# Altium schematic sheet ForceACQ.SchDoc: ForceACQ
size A4; Author: João Guimarães; Revision: 2.0; SheetNumber: 5; SheetTotal: 9
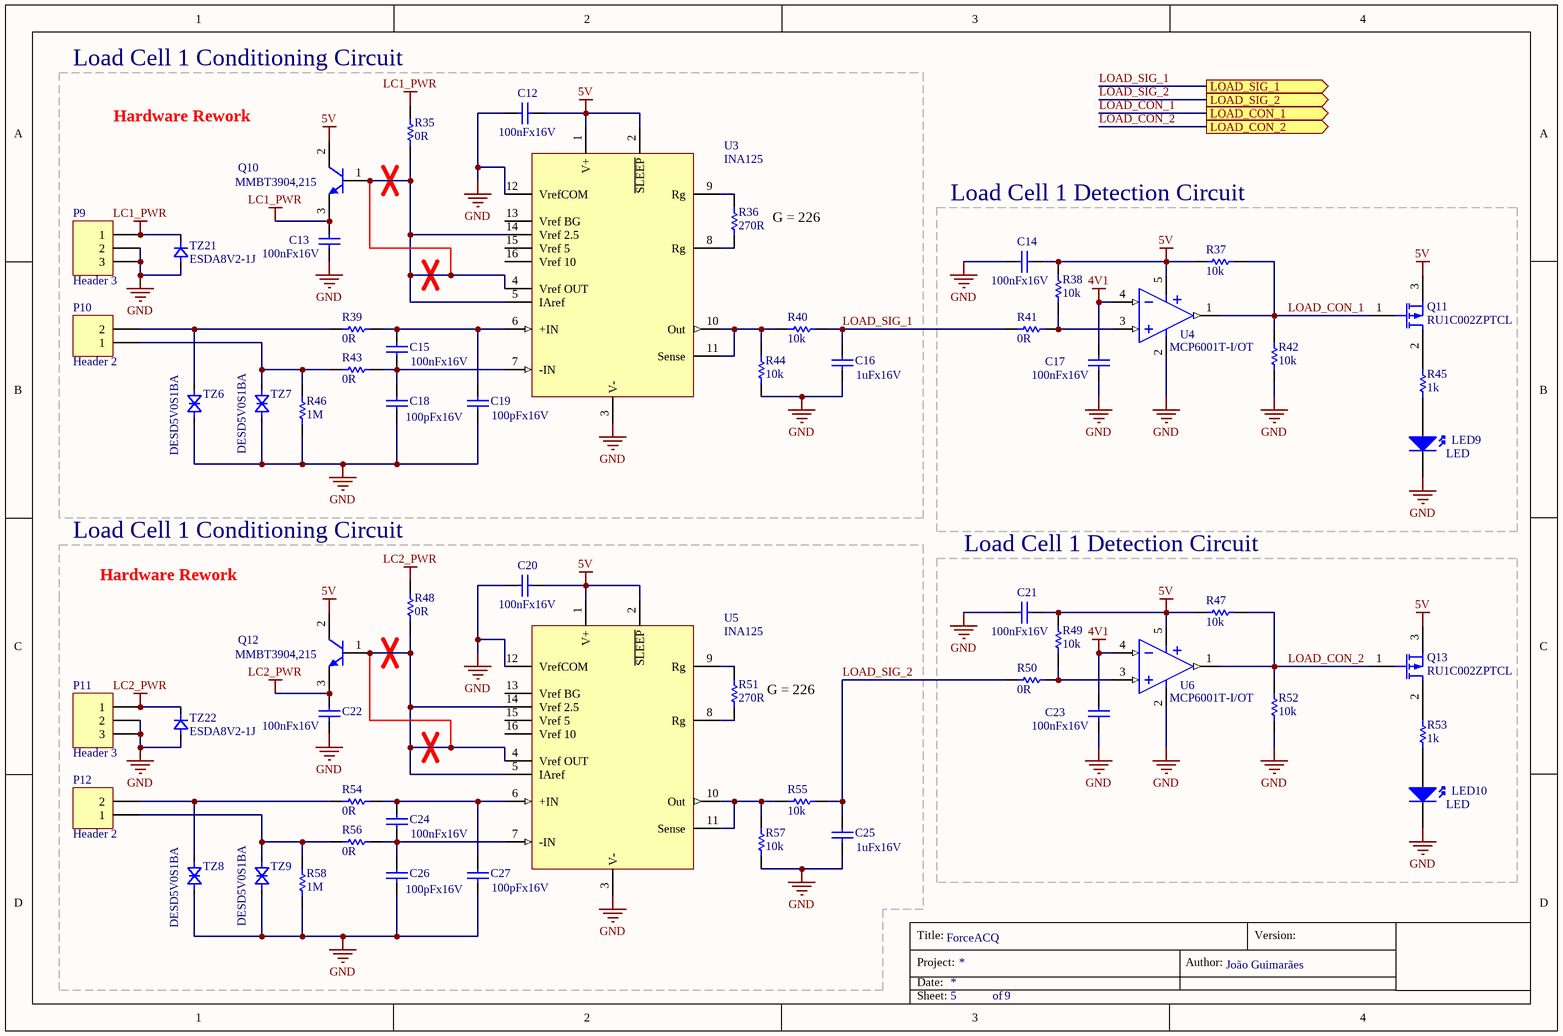
[diagram p0: ForceACQ.SchDoc]

## Parts
C12  100nFx16V  [DISC-0805]
C13  100nFx16V  [DISC-0805]
C14  100nFx16V  [DISC-0805]
C15  100nFx16V  [DISC-0805]
C16  1uFx16V  [DISC-0805]
C17  100nFx16V  [DISC-0805]
C18  100pFx16V  [DISC-0805]
C19  100pFx16V  [DISC-0805]
C20  100nFx16V  [DISC-0805]
C21  100nFx16V  [DISC-0805]
C22  100nFx16V  [DISC-0805]
C23  100nFx16V  [DISC-0805]
C24  100nFx16V  [DISC-0805]
C25  1uFx16V  [DISC-0805]
C26  100pFx16V  [DISC-0805]
C27  100pFx16V  [DISC-0805]
LED9  LED  [DISC-LED-0.1-PTH]
LED10  LED  [DISC-LED-0.1-PTH]
P9  Header 3  [CON-FLEXWIRE-0.5MM2-1X3]
P10  Header 2  [CON-FLEXWIRE-0.5MM2-1X2]
P11  Header 3  [CON-FLEXWIRE-0.5MM2-1X3]
P12  Header 2  [CON-FLEXWIRE-0.5MM2-1X2]
Q10  MMBT3904,215  [DISC-SOT-23]
Q11  RU1C002ZPTCL  [DISC-SOT-23]
Q12  MMBT3904,215  [DISC-SOT-23]
Q13  RU1C002ZPTCL  [DISC-SOT-23]
R35  0R  [DISC-0805]
R36  270R  [DISC-0805]
R37  10k  [DISC-0805]
R38  10k  [DISC-0805]
R39  0R  [DISC-0805]
R40  10k  [DISC-0805]
R41  0R  [DISC-0805]
R42  10k  [DISC-0805]
R43  0R  [DISC-0805]
R44  10k  [DISC-0805]
R45  1k  [DISC-0805]
R46  1M  [DISC-0805]
R47  10k  [DISC-0805]
R48  0R  [DISC-0805]
R49  10k  [DISC-0805]
R50  0R  [DISC-0805]
R51  270R  [DISC-0805]
R52  10k  [DISC-0805]
R53  1k  [DISC-0805]
R54  0R  [DISC-0805]
R55  10k  [DISC-0805]
R56  0R  [DISC-0805]
R57  10k  [DISC-0805]
R58  1M  [DISC-0805]
TZ6  DESD5V0S1BA  [DISC-SOD-323]
TZ7  DESD5V0S1BA  [DISC-SOD-323]
TZ8  DESD5V0S1BA  [DISC-SOD-323]
TZ9  DESD5V0S1BA  [DISC-SOD-323]
TZ21  ESDA8V2-1J  [DISC-SOD-323]
TZ22  ESDA8V2-1J  [DISC-SOD-323]
U3  INA125  [CI-SOIC-16]
U4  MCP6001T-I/OT  [CI-SOT-23-5]
U5  INA125  [CI-SOIC-16]
U6  MCP6001T-I/OT  [CI-SOT-23-5]

## Blocks framed on the sheet
Load Cell 1 Conditioning Circuit: C12 C13 C15 C16 C18 C19 P9 P10 Q10 R35 R36 R39 R40 R43 R44 R46 TZ6 TZ7 TZ21 U3
Load Cell 1 Detection Circuit: C14 C17 LED9 Q11 R37 R38 R41 R42 R45 U4
Load Cell 1 Conditioning Circuit: C20 C22 C24-C27 P11 P12 Q12 R48 R51 R54-R58 TZ8 TZ9 TZ22 U5
Load Cell 1 Detection Circuit: C21 C23 LED10 Q13 R47 R49 R50 R52 R53 U6

## Ports
LOAD_CON_1 (out), LOAD_CON_2 (out), LOAD_SIG_1 (out), LOAD_SIG_2 (out)

## Nets
4V1: C17.2 C23.2 U4.4(IN-) U6.4(IN-)
5V: C12.1 C14.2 C20.1 C21.2 Q10.2(C) Q11.3(S) Q12.2(C) Q13.3(S) R37.1 R38.1 R47.1 R49.1 U3.1(V+) U3.2(~{SLEEP}) U4.5(V+) U5.1(V+) U5.2(~{SLEEP}) U6.5(V+)
GND: C12.2 C13.1 C14.1 C16.1 C17.1 C18.1 C19.1 C20.2 C21.1 C22.1 C23.1 C25.1 C26.1 C27.1 LED9.2(K) LED10.2(K) P9.2 P9.3 P11.2 P11.3 R42.2 R44.2 R46.1 R52.2 R57.2 R58.1 TZ6.1(A) TZ7.1(A) TZ8.1(A) TZ9.1(A) TZ21.1(A) TZ22.1(A) U3.3(V-) U3.12(VrefCOM) U4.2(V-) U5.3(V-) U5.12(VrefCOM) U6.2(V-)
LC1_PWR: C13.2 P9.1 Q10.3(E) R35.1 TZ21.2(C)
LC2_PWR: C22.2 P11.1 Q12.3(E) R48.1 TZ22.2(C)
LOAD_CON_1: Q11.1(G) R37.2 R42.1 U4.1(Out) ; port LOAD_CON_1
LOAD_CON_2: Q13.1(G) R47.2 R52.1 U6.1(Out) ; port LOAD_CON_2
LOAD_SIG_1: C16.2 R40.2 R41.1 ; port LOAD_SIG_1
LOAD_SIG_2: C25.2 R50.1 R55.2 ; port LOAD_SIG_2
NetC15_1: C15.1 C18.2 R43.1 U3.7(-IN)
NetC15_2: C15.2 C19.2 R39.1 U3.6(+IN)
NetC24_1: C24.1 C26.2 R56.1 U5.7(-IN)
NetC24_2: C24.2 C27.2 R54.1 U5.6(+IN)
NetLED9_1: LED9.1(A) R45.1
NetLED10_1: LED10.1(A) R53.1
NetP10_1: P10.1 R43.2 R46.2 TZ7.2(K)
NetP10_2: P10.2 R39.2 TZ6.2(K)
NetP12_1: P12.1 R56.2 R58.2 TZ9.2(K)
NetP12_2: P12.2 R54.2 TZ8.2(K)
NetQ10_1: Q10.1(B) R35.2 U3.4(Vref_OUT) U3.5(IAref) U3.14(Vref_2.5)
NetQ11_2: Q11.2(D) R45.2
NetQ12_1: Q12.1(B) R48.2 U5.4(Vref_OUT) U5.5(IAref) U5.14(Vref_2.5)
NetQ13_2: Q13.2(D) R53.2
NetR36_1: R36.1 U3.9(Rg)
NetR36_2: R36.2 U3.8(Rg)
NetR38_2: R38.2 R41.2 U4.3(IN+)
NetR40_1: R40.1 R44.1 U3.10(Out) U3.11(Sense)
NetR49_2: R49.2 R50.2 U6.3(IN+)
NetR51_1: R51.1 U5.9(Rg)
NetR51_2: R51.2 U5.8(Rg)
NetR55_1: R55.1 R57.1 U5.10(Out) U5.11(Sense)

Not connected (* = marked no-connect by the designer): U3 13(Vref_BG) 15(Vref_5) 16(Vref_10); U5 13(Vref_BG) 15(Vref_5) 16(Vref_10)

## Notes on the sheet
- Hardware Rework
- (near R36) G = 226
- (near R51) G = 226
- Title:
- Project:
- Date:
- Author:
- Version:
- Sheet:
- of

## Library data of the parts
C12-C27 = Cap: Capacitor
P9 P11 = Header 3: Header, 3-Pin; LatestRevisionDate: 17-Jul-2002; LatestRevisionNote: Re-released for DXP Platform.; Publisher: Altium Limited
P10 P12 = Header 2: Header, 2-Pin; LatestRevisionDate: 17-Jul-2002; LatestRevisionNote: Re-released for DXP Platform.; Publisher: Altium Limited
Q10 Q12 = Transistor-NPN: NPN Bipolar Transistor; Published: 8-Jun-2000; LatestRevisionDate: 17-Jul-2002; LatestRevisionNote: Re-released for DXP Platform.; PackageReference: TO-226-AA; Publisher: Altium Limited; PackageDescription: TO, Flat Index; 3 In-Line, Axial Leads; Body Dia. 4.8mm; Leads 0.55 x 0.51 mm (max); Code_JEDEC: TO-226-AA
Q11 Q13 = Transistor-PMOS: P-Channel MOSFET
R35-R58 = Res: Resistor
TZ6-TZ9 = TVZ-Bi-Directional
TZ21 TZ22 = TVZ-Unidirectional
U3 U5 = INA125P: INSTRUMENTATION AMPLIFIER With Precision Voltage Reference
U4 U6 = MCP6001T-I/OT: Operational Amplifiers - Op Amps Single 1.8V 1MHz